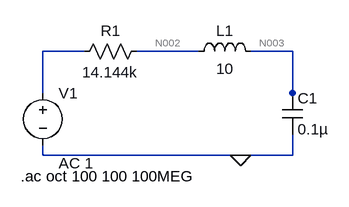
[diagram p0: schematic Draft24.asc]
Draft24.asc, the LTspice schematic file:
Version 4
SHEET 1 880 680
WIRE 80 48 16 48
WIRE 256 48 160 48
WIRE 400 48 336 48
WIRE 16 112 16 48
WIRE 400 112 400 48
WIRE 400 128 400 112
WIRE 16 208 16 192
WIRE 320 208 16 208
WIRE 400 208 400 176
WIRE 400 208 320 208
FLAG 320 208 0
SYMBOL voltage 16 96 R0
WINDOW 123 24 124 Left 2
WINDOW 39 0 0 Left 2
SYMATTR InstName V1
SYMATTR Value ""
SYMATTR Value2 AC 1
SYMBOL res 176 32 R90
WINDOW 0 0 56 VBottom 2
WINDOW 3 32 56 VTop 2
SYMATTR InstName R1
SYMATTR Value 14.144k
SYMBOL ind 240 64 R270
WINDOW 0 32 56 VTop 2
WINDOW 3 5 56 VBottom 2
SYMATTR InstName L1
SYMATTR Value 10
SYMBOL cap 384 112 R0
SYMATTR InstName C1
SYMATTR Value 0.1µ
TEXT -18 240 Left 2 !.ac oct 100 100 100MEG

The netlist it stands for:
* Draft24.asc
V1 N001 0 AC 1
R1 N002 N001 14.144k
L1 N002 N003 10
C1 N003 0 0.1µ
.ac oct 100 100 100MEG
.backanno
.end

* Results of the author's LTspice run, read from the files saved beside the schematic
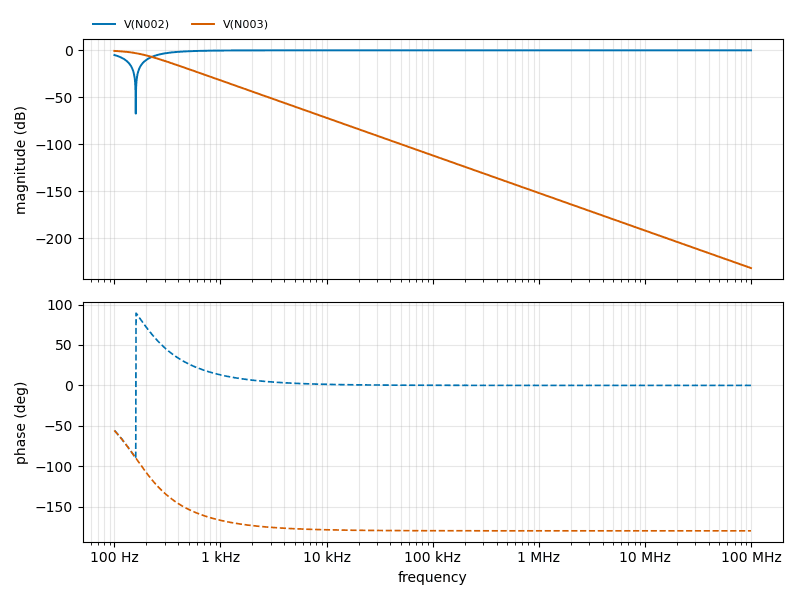
[diagram p1: AC Analysis of Draft24.asc, plotted from the saved traces]
* AC Analysis, 1 run:
*   V(N002): -4.99 dB at 100 Hz, -0.00 dB at 100 MHz, peak -0.00 dB at 100 MHz, 3 dB below the peak at 307.5 Hz
*   V(N003): -0.63 dB at 100 Hz, -231.93 dB at 100 MHz, peak -0.63 dB at 100 Hz, 3 dB below the peak at 170.3 Hz